# EAGLE schematic alu (EAGLE 9.1.3)
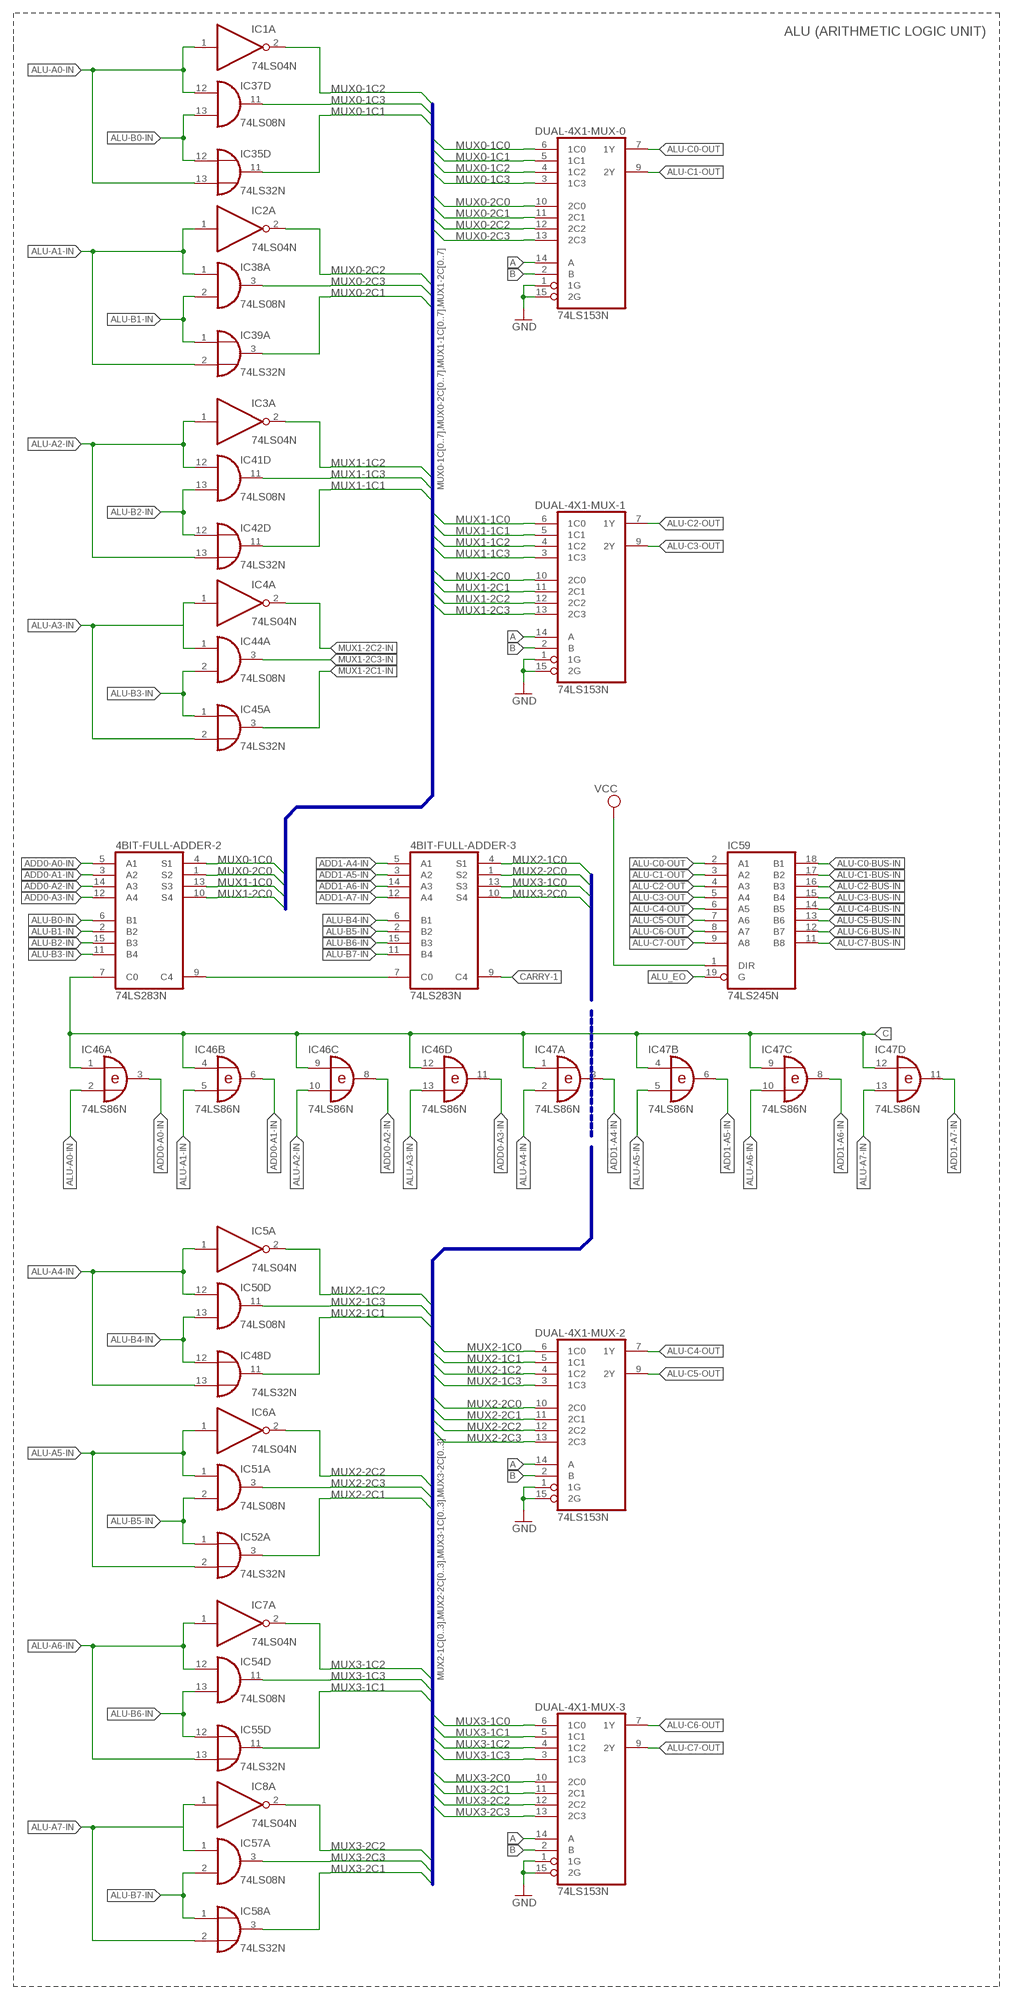
[diagram p0: schematic, sheet 1]

## Parts
4BIT-FULL-ADDER-2  74LS283N  [DIL16]
4BIT-FULL-ADDER-3  74LS283N  [DIL16]
DUAL-4X1-MUX-0  74LS153N  [DIL16]
DUAL-4X1-MUX-1  74LS153N  [DIL16]
DUAL-4X1-MUX-2  74LS153N  [DIL16]
DUAL-4X1-MUX-3  74LS153N  [DIL16]
IC1  74LS04N  [DIL14]
IC2  74LS04N  [DIL14]
IC3  74LS04N  [DIL14]
IC4  74LS04N  [DIL14]
IC5  74LS04N  [DIL14]
IC6  74LS04N  [DIL14]
IC7  74LS04N  [DIL14]
IC8  74LS04N  [DIL14]
IC35  74LS32N  [DIL14]
IC37  74LS08N  [DIL14]
IC38  74LS08N  [DIL14]
IC39  74LS32N  [DIL14]
IC41  74LS08N  [DIL14]
IC42  74LS32N  [DIL14]
IC44  74LS08N  [DIL14]
IC45  74LS32N  [DIL14]
IC46  74LS86N  [DIL14]
IC47  74LS86N  [DIL14]
IC48  74LS32N  [DIL14]
IC50  74LS08N  [DIL14]
IC51  74LS08N  [DIL14]
IC52  74LS32N  [DIL14]
IC54  74LS08N  [DIL14]
IC55  74LS32N  [DIL14]
IC57  74LS08N  [DIL14]
IC58  74LS32N  [DIL14]
IC59  74LS245N  [DIL20]

## Nets
A: DUAL-4X1-MUX-0.14(A) DUAL-4X1-MUX-1.14(A) DUAL-4X1-MUX-2.14(A) DUAL-4X1-MUX-3.14(A)
ADD0-A0-IN: 4BIT-FULL-ADDER-2.5(A1) IC46.3(A:O)
ADD0-A1-IN: 4BIT-FULL-ADDER-2.3(A2) IC46.6(B:O)
ADD0-A2-IN: 4BIT-FULL-ADDER-2.14(A3) IC46.8(C:O)
ADD0-A3-IN: 4BIT-FULL-ADDER-2.12(A4) IC46.11(D:O)
ADD1-A4-IN: 4BIT-FULL-ADDER-3.5(A1) IC47.3(A:O)
ADD1-A5-IN: 4BIT-FULL-ADDER-3.3(A2) IC47.6(B:O)
ADD1-A6-IN: 4BIT-FULL-ADDER-3.14(A3) IC47.8(C:O)
ADD1-A7-IN: 4BIT-FULL-ADDER-3.12(A4) IC47.11(D:O)
ALU-A0-IN: IC1.1(A:I) IC35.13(D:I1) IC37.12(D:I0) IC46.2(A:I1)
ALU-A1-IN: IC2.1(A:I) IC38.1(A:I0) IC39.2(A:I1) IC46.5(B:I1)
ALU-A2-IN: IC3.1(A:I) IC41.12(D:I0) IC42.13(D:I1) IC46.10(C:I1)
ALU-A3-IN: IC4.1(A:I) IC44.1(A:I0) IC45.2(A:I1) IC46.13(D:I1)
ALU-A4-IN: IC5.1(A:I) IC47.2(A:I1) IC48.13(D:I1) IC50.12(D:I0)
ALU-A5-IN: IC6.1(A:I) IC47.5(B:I1) IC51.1(A:I0) IC52.2(A:I1)
ALU-A6-IN: IC7.1(A:I) IC47.10(C:I1) IC54.12(D:I0) IC55.13(D:I1)
ALU-A7-IN: IC8.1(A:I) IC47.13(D:I1) IC57.1(A:I0) IC58.2(A:I1)
ALU-B0-IN: 4BIT-FULL-ADDER-2.6(B1) IC35.12(D:I0) IC37.13(D:I1)
ALU-B1-IN: 4BIT-FULL-ADDER-2.2(B2) IC38.2(A:I1) IC39.1(A:I0)
ALU-B2-IN: 4BIT-FULL-ADDER-2.15(B3) IC41.13(D:I1) IC42.12(D:I0)
ALU-B3-IN: 4BIT-FULL-ADDER-2.11(B4) IC44.2(A:I1) IC45.1(A:I0)
ALU-B4-IN: 4BIT-FULL-ADDER-3.6(B1) IC48.12(D:I0) IC50.13(D:I1)
ALU-B5-IN: 4BIT-FULL-ADDER-3.2(B2) IC51.2(A:I1) IC52.1(A:I0)
ALU-B6-IN: 4BIT-FULL-ADDER-3.15(B3) IC54.13(D:I1) IC55.12(D:I0)
ALU-B7-IN: 4BIT-FULL-ADDER-3.11(B4) IC57.2(A:I1) IC58.1(A:I0)
ALU-C0-BUS-IN: IC59.18(B1)
ALU-C0-OUT: DUAL-4X1-MUX-0.7(1Y) IC59.2(A1)
ALU-C1-BUS-IN: IC59.17(B2)
ALU-C1-OUT: DUAL-4X1-MUX-0.9(2Y) IC59.3(A2)
ALU-C2-BUS-IN: IC59.16(B3)
ALU-C2-OUT: DUAL-4X1-MUX-1.7(1Y) IC59.4(A3)
ALU-C3-BUS-IN: IC59.15(B4)
ALU-C3-OUT: DUAL-4X1-MUX-1.9(2Y) IC59.5(A4)
ALU-C4-BUS-IN: IC59.14(B5)
ALU-C4-OUT: DUAL-4X1-MUX-2.7(1Y) IC59.6(A5)
ALU-C5-BUS-IN: IC59.13(B6)
ALU-C5-OUT: DUAL-4X1-MUX-2.9(2Y) IC59.7(A6)
ALU-C6-BUS-IN: IC59.12(B7)
ALU-C6-OUT: DUAL-4X1-MUX-3.7(1Y) IC59.8(A7)
ALU-C7-BUS-IN: IC59.11(B8)
ALU-C7-OUT: DUAL-4X1-MUX-3.9(2Y) IC59.9(A8)
ALU_EO: IC59.19(G)
B: DUAL-4X1-MUX-0.2(B) DUAL-4X1-MUX-1.2(B) DUAL-4X1-MUX-2.2(B) DUAL-4X1-MUX-3.2(B)
C: 4BIT-FULL-ADDER-2.7(C0) IC46.1(A:I0) IC46.4(B:I0) IC46.9(C:I0) IC46.12(D:I0) IC47.1(A:I0) IC47.4(B:I0) IC47.9(C:I0) IC47.12(D:I0)
CARRY-1: 4BIT-FULL-ADDER-3.9(C4)
GND: DUAL-4X1-MUX-0.1(1G) DUAL-4X1-MUX-0.15(2G) DUAL-4X1-MUX-1.1(1G) DUAL-4X1-MUX-1.15(2G) DUAL-4X1-MUX-2.1(1G) DUAL-4X1-MUX-2.15(2G) DUAL-4X1-MUX-3.1(1G) DUAL-4X1-MUX-3.15(2G)
MUX0-1C0: 4BIT-FULL-ADDER-2.4(S1) DUAL-4X1-MUX-0.6(1C0)
MUX0-1C1: DUAL-4X1-MUX-0.5(1C1) IC35.11(D:O)
MUX0-1C2: DUAL-4X1-MUX-0.4(1C2) IC1.2(A:O)
MUX0-1C3: DUAL-4X1-MUX-0.3(1C3) IC37.11(D:O)
MUX0-2C0: 4BIT-FULL-ADDER-2.1(S2) DUAL-4X1-MUX-0.10(2C0)
MUX0-2C1: DUAL-4X1-MUX-0.11(2C1) IC39.3(A:O)
MUX0-2C2: DUAL-4X1-MUX-0.12(2C2) IC2.2(A:O)
MUX0-2C3: DUAL-4X1-MUX-0.13(2C3) IC38.3(A:O)
MUX1-1C0: 4BIT-FULL-ADDER-2.13(S3) DUAL-4X1-MUX-1.6(1C0)
MUX1-1C1: DUAL-4X1-MUX-1.5(1C1) IC42.11(D:O)
MUX1-1C2: DUAL-4X1-MUX-1.4(1C2) IC3.2(A:O)
MUX1-1C3: DUAL-4X1-MUX-1.3(1C3) IC41.11(D:O)
MUX1-2C0: 4BIT-FULL-ADDER-2.10(S4) DUAL-4X1-MUX-1.10(2C0)
MUX1-2C1: DUAL-4X1-MUX-1.11(2C1)
MUX1-2C1-IN: IC45.3(A:O)
MUX1-2C2: DUAL-4X1-MUX-1.12(2C2)
MUX1-2C2-IN: IC4.2(A:O)
MUX1-2C3: DUAL-4X1-MUX-1.13(2C3)
MUX1-2C3-IN: IC44.3(A:O)
MUX2-1C0: 4BIT-FULL-ADDER-3.4(S1) DUAL-4X1-MUX-2.6(1C0)
MUX2-1C1: DUAL-4X1-MUX-2.5(1C1) IC48.11(D:O)
MUX2-1C2: DUAL-4X1-MUX-2.4(1C2) IC5.2(A:O)
MUX2-1C3: DUAL-4X1-MUX-2.3(1C3) IC50.11(D:O)
MUX2-2C0: 4BIT-FULL-ADDER-3.1(S2) DUAL-4X1-MUX-2.10(2C0)
MUX2-2C1: DUAL-4X1-MUX-2.11(2C1) IC52.3(A:O)
MUX2-2C2: DUAL-4X1-MUX-2.12(2C2) IC6.2(A:O)
MUX2-2C3: DUAL-4X1-MUX-2.13(2C3) IC51.3(A:O)
MUX3-1C0: 4BIT-FULL-ADDER-3.13(S3) DUAL-4X1-MUX-3.6(1C0)
MUX3-1C1: DUAL-4X1-MUX-3.5(1C1) IC55.11(D:O)
MUX3-1C2: DUAL-4X1-MUX-3.4(1C2) IC7.2(A:O)
MUX3-1C3: DUAL-4X1-MUX-3.3(1C3) IC54.11(D:O)
MUX3-2C0: 4BIT-FULL-ADDER-3.10(S4) DUAL-4X1-MUX-3.10(2C0)
MUX3-2C1: DUAL-4X1-MUX-3.11(2C1) IC58.3(A:O)
MUX3-2C2: DUAL-4X1-MUX-3.12(2C2) IC8.2(A:O)
MUX3-2C3: DUAL-4X1-MUX-3.13(2C3) IC57.3(A:O)
N$1: 4BIT-FULL-ADDER-2.9(C4) 4BIT-FULL-ADDER-3.7(C0)
VCC: IC59.1(DIR)
Unconnected: IC1.3(B:I) IC1.4(B:O) IC1.5(C:I) IC1.6(C:O) IC1.8(D:O) IC1.9(D:I) IC1.10(E:O) IC1.11(E:I) IC1.12(F:O) IC1.13(F:I) IC2.3(B:I) IC2.4(B:O) IC2.5(C:I) IC2.6(C:O) IC2.8(D:O) IC2.9(D:I) IC2.10(E:O) IC2.11(E:I) IC2.12(F:O) IC2.13(F:I) IC3.3(B:I) IC3.4(B:O) IC3.5(C:I) IC3.6(C:O) IC3.8(D:O) IC3.9(D:I) IC3.10(E:O) IC3.11(E:I) IC3.12(F:O) IC3.13(F:I) IC4.3(B:I) IC4.4(B:O) IC4.5(C:I) IC4.6(C:O) IC4.8(D:O) IC4.9(D:I) IC4.10(E:O) IC4.11(E:I) IC4.12(F:O) IC4.13(F:I) IC5.3(B:I) IC5.4(B:O) IC5.5(C:I) IC5.6(C:O) IC5.8(D:O) IC5.9(D:I) IC5.10(E:O) IC5.11(E:I) IC5.12(F:O) IC5.13(F:I) IC6.3(B:I) IC6.4(B:O) IC6.5(C:I) IC6.6(C:O) IC6.8(D:O) IC6.9(D:I) IC6.10(E:O) IC6.11(E:I) IC6.12(F:O) IC6.13(F:I) IC7.3(B:I) IC7.4(B:O) IC7.5(C:I) IC7.6(C:O) IC7.8(D:O) IC7.9(D:I) IC7.10(E:O) IC7.11(E:I) IC7.12(F:O) IC7.13(F:I) IC8.3(B:I) IC8.4(B:O) IC8.5(C:I) IC8.6(C:O) IC8.8(D:O) IC8.9(D:I) IC8.10(E:O) IC8.11(E:I) IC8.12(F:O) IC8.13(F:I) IC35.1(A:I0) IC35.2(A:I1) IC35.3(A:O) IC35.4(B:I0) IC35.5(B:I1) IC35.6(B:O) IC35.8(C:O) IC35.9(C:I0) IC35.10(C:I1) IC37.1(A:I0) IC37.2(A:I1) IC37.3(A:O) IC37.4(B:I0) IC37.5(B:I1) IC37.6(B:O) IC37.8(C:O) IC37.9(C:I0) IC37.10(C:I1) IC38.4(B:I0) IC38.5(B:I1) IC38.6(B:O) IC38.8(C:O) IC38.9(C:I0) IC38.10(C:I1) IC38.11(D:O) IC38.12(D:I0) IC38.13(D:I1) IC39.4(B:I0) IC39.5(B:I1) IC39.6(B:O) IC39.8(C:O) IC39.9(C:I0) IC39.10(C:I1) IC39.11(D:O) IC39.12(D:I0) IC39.13(D:I1) IC41.1(A:I0) IC41.2(A:I1) IC41.3(A:O) IC41.4(B:I0) IC41.5(B:I1) IC41.6(B:O) IC41.8(C:O) IC41.9(C:I0) IC41.10(C:I1) IC42.1(A:I0) IC42.2(A:I1) IC42.3(A:O) IC42.4(B:I0) IC42.5(B:I1) IC42.6(B:O) IC42.8(C:O) IC42.9(C:I0) IC42.10(C:I1) IC44.4(B:I0) IC44.5(B:I1) IC44.6(B:O) IC44.8(C:O) IC44.9(C:I0) IC44.10(C:I1) IC44.11(D:O) IC44.12(D:I0) IC44.13(D:I1) IC45.4(B:I0) IC45.5(B:I1) IC45.6(B:O) IC45.8(C:O) IC45.9(C:I0) IC45.10(C:I1) IC45.11(D:O) IC45.12(D:I0) IC45.13(D:I1) IC48.1(A:I0) IC48.2(A:I1) IC48.3(A:O) IC48.4(B:I0) IC48.5(B:I1) IC48.6(B:O) IC48.8(C:O) IC48.9(C:I0) IC48.10(C:I1) IC50.1(A:I0) IC50.2(A:I1) IC50.3(A:O) IC50.4(B:I0) IC50.5(B:I1) IC50.6(B:O) IC50.8(C:O) IC50.9(C:I0) IC50.10(C:I1) IC51.4(B:I0) IC51.5(B:I1) IC51.6(B:O) IC51.8(C:O) IC51.9(C:I0) IC51.10(C:I1) IC51.11(D:O) IC51.12(D:I0) IC51.13(D:I1) IC52.4(B:I0) IC52.5(B:I1) IC52.6(B:O) IC52.8(C:O) IC52.9(C:I0) IC52.10(C:I1) IC52.11(D:O) IC52.12(D:I0) IC52.13(D:I1) IC54.1(A:I0) IC54.2(A:I1) IC54.3(A:O) IC54.4(B:I0) IC54.5(B:I1) IC54.6(B:O) IC54.8(C:O) IC54.9(C:I0) IC54.10(C:I1) IC55.1(A:I0) IC55.2(A:I1) IC55.3(A:O) IC55.4(B:I0) IC55.5(B:I1) IC55.6(B:O) IC55.8(C:O) IC55.9(C:I0) IC55.10(C:I1) IC57.4(B:I0) IC57.5(B:I1) IC57.6(B:O) IC57.8(C:O) IC57.9(C:I0) IC57.10(C:I1) IC57.11(D:O) IC57.12(D:I0) IC57.13(D:I1) IC58.4(B:I0) IC58.5(B:I1) IC58.6(B:O) IC58.8(C:O) IC58.9(C:I0) IC58.10(C:I1) IC58.11(D:O) IC58.12(D:I0) IC58.13(D:I1)

## Buses
MUX0-1C[0..7],MUX0-2C[0..7],MUX1-1C[0..7],MUX1-2C[0..7]
MUX2-1C[0..3],MUX2-2C[0..3],MUX3-1C[0..3],MUX3-2C[0..3]

## Notes on the sheet
- ALU (ARITHMETIC LOGIC UNIT)

## Power pins joined to a net without a drawn wire
GND: 4BIT-FULL-ADDER-2.8(GND) 4BIT-FULL-ADDER-3.8(GND) DUAL-4X1-MUX-0.8(GND) DUAL-4X1-MUX-1.8(GND) DUAL-4X1-MUX-2.8(GND) DUAL-4X1-MUX-3.8(GND) IC1.7(P:GND) IC2.7(P:GND) IC3.7(P:GND) IC4.7(P:GND) IC5.7(P:GND) IC6.7(P:GND) IC7.7(P:GND) IC8.7(P:GND) IC35.7(P:GND) IC37.7(P:GND) IC38.7(P:GND) IC39.7(P:GND) IC41.7(P:GND) IC42.7(P:GND) IC44.7(P:GND) IC45.7(P:GND) IC46.7(P:GND) IC47.7(P:GND) IC48.7(P:GND) IC50.7(P:GND) IC51.7(P:GND) IC52.7(P:GND) IC54.7(P:GND) IC55.7(P:GND) IC57.7(P:GND) IC58.7(P:GND) IC59.10(GND)
VCC: 4BIT-FULL-ADDER-2.16(VCC) 4BIT-FULL-ADDER-3.16(VCC) DUAL-4X1-MUX-0.16(VCC) DUAL-4X1-MUX-1.16(VCC) DUAL-4X1-MUX-2.16(VCC) DUAL-4X1-MUX-3.16(VCC) IC1.14(P:VCC) IC2.14(P:VCC) IC3.14(P:VCC) IC4.14(P:VCC) IC5.14(P:VCC) IC6.14(P:VCC) IC7.14(P:VCC) IC8.14(P:VCC) IC35.14(P:VCC) IC37.14(P:VCC) IC38.14(P:VCC) IC39.14(P:VCC) IC41.14(P:VCC) IC42.14(P:VCC) IC44.14(P:VCC) IC45.14(P:VCC) IC46.14(P:VCC) IC47.14(P:VCC) IC48.14(P:VCC) IC50.14(P:VCC) IC51.14(P:VCC) IC52.14(P:VCC) IC54.14(P:VCC) IC55.14(P:VCC) IC57.14(P:VCC) IC58.14(P:VCC) IC59.20(VCC)

## Library data of the parts
4BIT-FULL-ADDER-2 4BIT-FULL-ADDER-3 = 74xx-eu:74*283: 4-bit binary FULL ADDER, fast carry
DUAL-4X1-MUX-0 DUAL-4X1-MUX-1-DUAL-4X1-MUX-3 = 74xx-eu:74*153: Dual 4-line to 1-line data SELECTOR/MULTIPLEXER
IC1-IC8 = 74xx-eu:74*04: Hex INVERTER
IC35 IC39 IC42 IC45 IC48 IC52 IC55 IC58 = 74xx-eu:74*32: Quad 2-input OR gate
IC37 IC38 IC41 IC44 IC50 IC51 IC54 IC57 = 74xx-eu:74*08: Quad 2-input AND gate
IC46 IC47 = 74xx-eu:74*86: Quad 2-input EXCLUSIVE-OR (XOR) gate
IC59 = 74xx-eu:74*245: Octal BUS TRANSCEIVER, 3-state